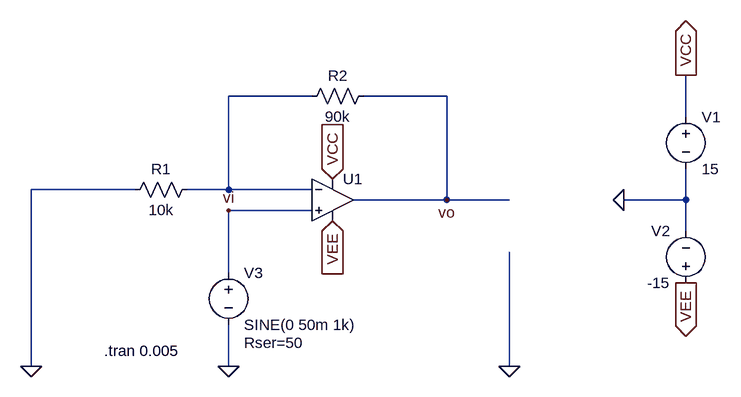
[diagram p0: schematic Lab2p2.asc]
Lab2p2.asc, the LTspice schematic file:
Version 4
SHEET 1 984 856
WIRE 192 -64 64 -64
WIRE 400 -64 272 -64
WIRE 768 -32 768 -96
WIRE -80 80 -240 80
WIRE 64 80 64 -64
WIRE 64 80 0 80
WIRE 192 80 64 80
WIRE 400 96 400 -64
WIRE 400 96 256 96
WIRE 496 96 400 96
WIRE 768 96 768 48
WIRE 768 96 672 96
WIRE 192 112 64 112
WIRE 768 144 768 96
WIRE 64 208 64 112
WIRE -240 352 -240 80
WIRE 64 352 64 288
WIRE 496 352 496 176
FLAG 224 128 VEE
IOPIN 224 128 In
FLAG 224 64 VCC
IOPIN 224 64 In
FLAG 672 96 0
FLAG 768 -96 VCC
IOPIN 768 -96 Out
FLAG 768 224 VEE
IOPIN 768 224 Out
FLAG 400 96 vo
FLAG 64 352 0
FLAG -240 352 0
FLAG 496 352 0
FLAG 64 112 vi
SYMBOL OpAmps\\UniversalOpAmp2 224 96 R0
SYMATTR InstName U1
SYMATTR Value2 Avol=200k GBW=1.5Meg Slew=0.5Meg
SYMATTR SpiceLine Ilimit=25m Rail=1 Vos=1m
SYMATTR SpiceLine2 En=0 Enk=0 In=0 Ink=0 Rin=2Meg
SYMBOL voltage 768 -48 R0
SYMATTR InstName V1
SYMATTR Value 15
SYMBOL voltage 768 240 R180
WINDOW 0 24 96 Left 2
WINDOW 3 24 16 Left 2
SYMATTR InstName V2
SYMATTR Value -15
SYMBOL voltage 64 192 R0
WINDOW 123 0 0 Left 0
WINDOW 39 24 124 Left 2
SYMATTR SpiceLine Rser=50
SYMATTR InstName V3
SYMATTR Value SINE(0 50m 1k)
SYMBOL res 16 64 R90
WINDOW 0 0 56 VBottom 2
WINDOW 3 32 56 VTop 2
SYMATTR InstName R1
SYMATTR Value 10k
SYMBOL res 288 -80 R90
WINDOW 0 0 56 VBottom 2
WINDOW 3 32 56 VTop 2
SYMATTR InstName R2
SYMATTR Value 90k
TEXT -128 328 Left 2 !.tran 0.005

The netlist it stands for:
* Lab2p2.asc
XU1 vi N001 VCC VEE vo level2 Avol=200k GBW=1.5Meg Slew=0.5Meg Ilimit=25m Rail=1 Vos=1m En=0 Enk=0 In=0 Ink=0 Rin=2Meg  ; pins In+ In- V+ V- OUT
V1 VCC 0 15
V2 VEE 0 -15
V3 vi 0 SINE(0 50m 1k) Rser=50
R1 N001 0 10k
R2 vo N001 90k
.tran 0.005
.lib UniversalOpAmp2.lib
.backanno
.end